# Altium schematic sheet [2]Battery.SchDoc
size B
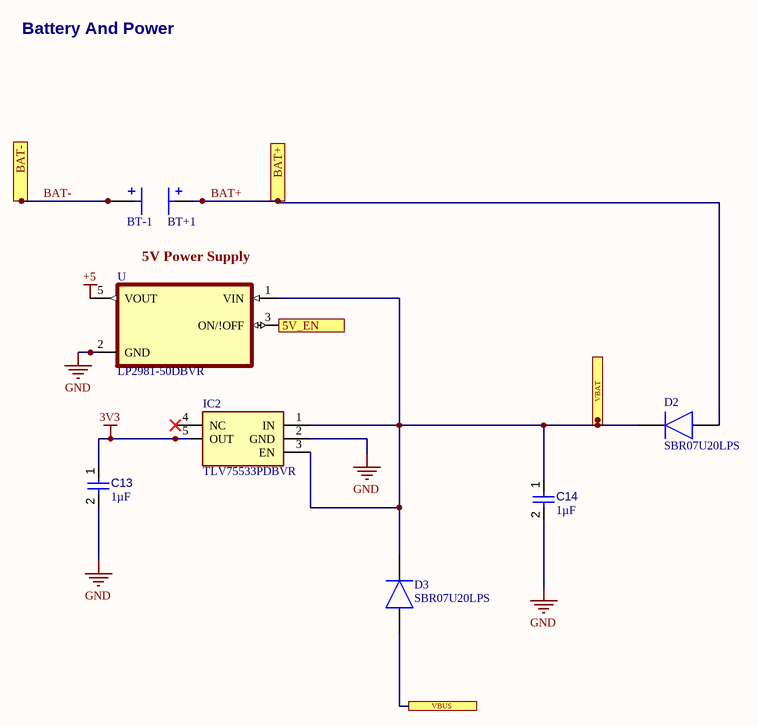
[diagram p0: [2]Battery.SchDoc]

## Parts
BT+1  BATTERY CONTACT CLIP A/AA PC PIN  [BAT_BK-82]  (value not drawn)
BT-1  BATTERY CONTACT CLIP A/AA PC PIN  [BAT_BK-82]  (value not drawn)
C13  value 1µF  [CAPC1608X90X40ML10T20]  (hidden comment: Capacitor 1 uF +/- 10% 25 V 0603)
C14  value 1µF  [CAPC1608X90X40ML10T20]  (hidden comment: Capacitor 1 uF +/- 10% 25 V 0603)
D2  SBR07U20LPS  [CDBQR70HF]
D3  SBR07U20LPS  [CDBQR70HF]
IC2  TLV75533PDBVR  [SOT95P280X145-5N]
U  LP2981-50DBVR  [SOT95P280X145-5N]

## Ports
5V_EN, BAT+, BAT-, VBAT, VBUS

## Nets
3V3: C13.1 IC2.5(OUT)
+5: U.5(VOUT)
GND: C13.2 C14.2 IC2.2(GND) U.2(GND)
5V_EN: U.3(ON/!OFF) ; port 5V_EN
BAT+: BT+1.S1(POS) BT+1.S2(POS) D2.2(A) ; port BAT+
BAT-: BT-1.S1(POS) BT-1.S2(POS) ; port BAT-
VBAT: C14.1 D2.1(K) D3.1(K) IC2.1(IN) IC2.3(EN) U.1(VIN) ; port VBAT
VBUS: D3.2(A) ; port VBUS

Not connected (* = marked no-connect by the designer): IC2 4(NC)*

## Notes on the sheet
- Battery And Power
- 5V Power Supply
- Title
- Size:
- Date:
- A3
- Number:
- Time:
- Revision:
- Sheet
- of
- File:

## Library data of the parts
BT+1 BT-1 = BK-82: Battery Contact Clip A, AA 1 Cell PC Pin; MF PN: 92 -Keystone Electronics; DK PN: 36-92-ND; Value: *; Availability: Unavailable; Package: None; Price: None
C13 C14 = CMP-001-00005-4: Chip Capacitor, 1 uF, +/- 10%, 25 V, 0603 (1608 Metric); Voltage Rating: 25V; Capacitor Type: Ceramic; Min Operating Temperature: -55°C; Tolerance: 10%; Max Operating Temperature: 125°C; Case/Package: 0603; RoHS Compliant: True; Mounting Technology: SM; Pins: 2
D2 D3 = CDSQR4148-HF_1: Diode; Manufacturer_Name: Comchip Technology; Datasheet Link: http://www.comchiptech.com/admin/files/product/CDSQR4148-HF-RevC213424.pdf; Height: 0mm; Manufacturer_Part_Number: CDSQR4148-HF; Arrow Part Number: CDSQR4148-HF; Arrow Price/Stock: https://www.arrow.com/en/products/cdsqr4148-hf/comchip-technology; Mouser Part Number: 750-CDSQR4148-HF; Mouser Price/Stock: https://www.mouser.co.uk/ProductDetail/Comchip-Technology/CDSQR4148-HF?qs=2qJf6qQ4IOKNV97fk6Xvow%3D%3D; ComponentLink1Description: SBR07U20LPS; ComponentLink1URL: https://www.diodes.com/assets/Datasheets/SBR07U20LPS.pdf
IC2 = TLV75533PDBVR: Integrated Circuit; Manufacturer_Name: Texas Instruments; Datasheet Link: http://www.ti.com/lit/gpn/tlv755p; Height: 1.45mm; Manufacturer_Part_Number: TLV75533PDBVR; Mouser Part Number: 595-TLV75533PDBVR; Mouser Price/Stock: https://www.mouser.co.uk/ProductDetail/Texas-Instruments/TLV75533PDBVR?qs=55YtniHzbhAKEwqeO2xJXQ%3D%3D; Arrow Part Number: TLV75533PDBVR; Arrow Price/Stock: https://www.arrow.com/en/products/tlv75533pdbvr/texas-instruments
U = LP2981-50DBVR: 100-mA, 16-V, low-dropout voltage regulator with enable 5-SOT-23 -40 to 125; MF: Texas Instruments; Package: SOT-23-5 Texas Instruments; SnapEDA_Link: https://www.snapeda.com/parts/LP2981-50DBVR/Texas%20Instruments/view-part/472200/?ref=snap; DigiKey-Purchase-URL: https://snapeda.com/shop?store=DigiKey&id=472200; MP: LP2981-50DBVR; Value: *; Arrow_Electronics-Purchase-URL: https://snapeda.com/shop?store=Arrow+Electronics&id=472200; Availability: Unavailable; Texas_Instruments-Purchase-URL: https://snapeda.com/shop?store=Texas+Instruments&id=472200; Price: None; Mouser-Purchase-URL: https://snapeda.com/shop?store=Mouser&id=472200